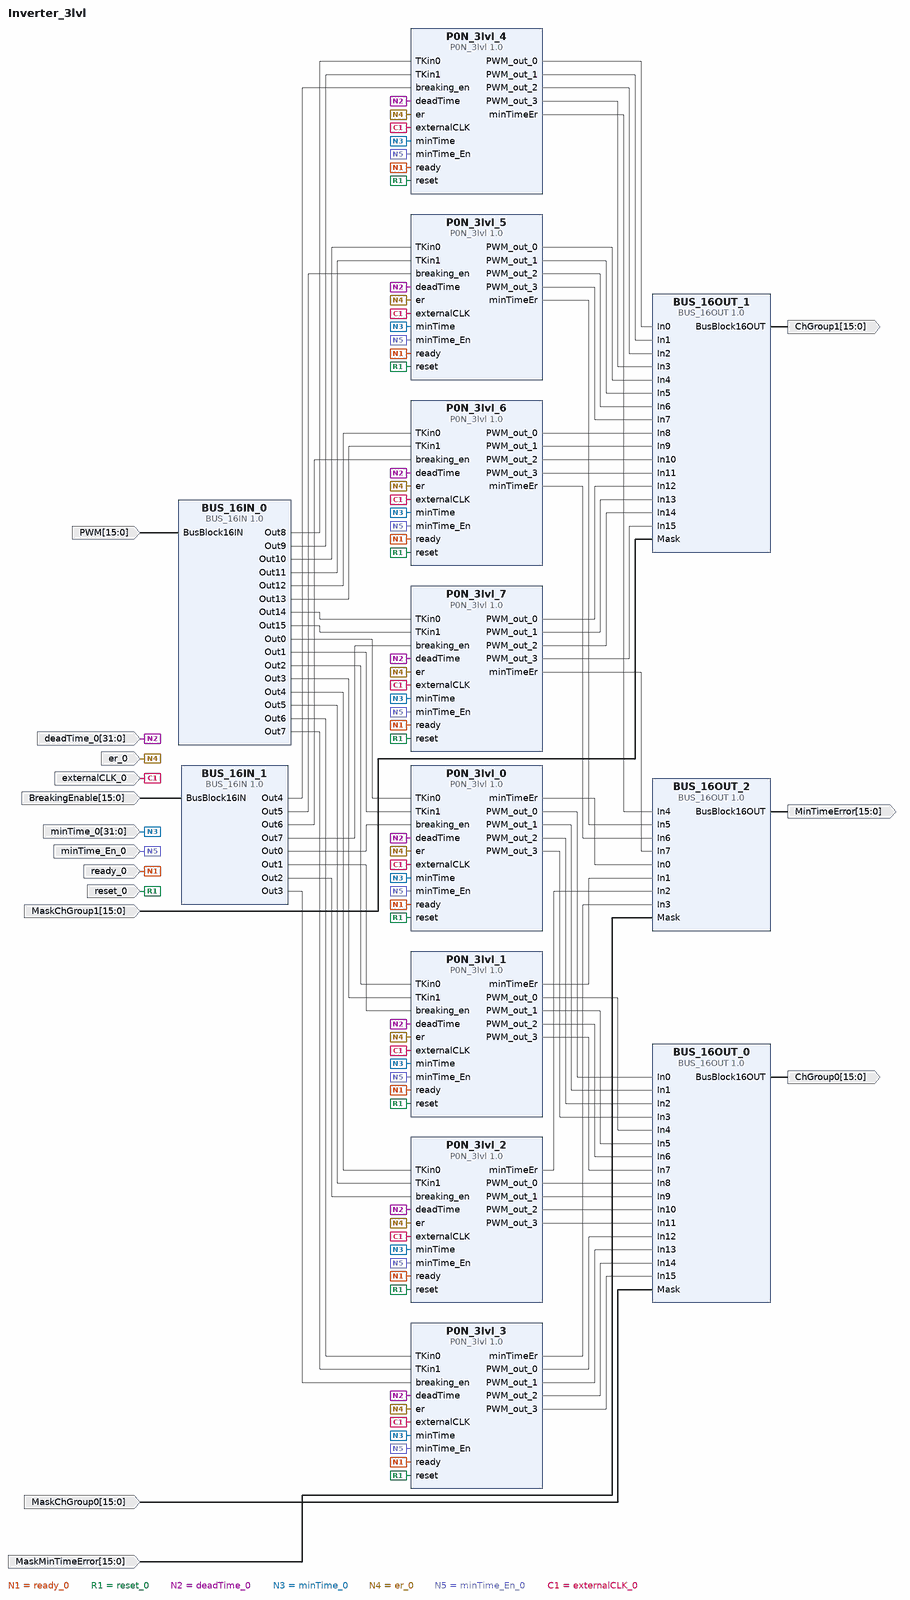
[diagram p0: block diagram of the top level]
# Vivado block design Inverter_3lvl, xc7z020clg484-3, Vivado 2019.1
create_bd_design Inverter_3lvl

create_bd_port -dir I ready_0
create_bd_port -dir I -type rst reset_0
create_bd_port -dir I -from 31 -to 0 deadTime_0
create_bd_port -dir I -from 31 -to 0 minTime_0
create_bd_port -dir I er_0
create_bd_port -dir I minTime_En_0
create_bd_port -dir I -from 15 -to 0 -type data BreakingEnable
create_bd_port -dir I -from 15 -to 0 -type data PWM
create_bd_port -dir O -from 15 -to 0 -type data ChGroup0
create_bd_port -dir O -from 15 -to 0 -type data ChGroup1
create_bd_port -dir O -from 15 -to 0 -type data MinTimeError
create_bd_port -dir I -from 15 -to 0 MaskChGroup1
create_bd_port -dir I -from 15 -to 0 MaskMinTimeError
create_bd_port -dir I -from 15 -to 0 MaskChGroup0
create_bd_port -dir I externalCLK_0

create_bd_cell -type ip -vlnv setcorp:user:BUS_16OUT:1.0 BUS_16OUT_0
create_bd_cell -type ip -vlnv setcorp:user:BUS_16OUT:1.0 BUS_16OUT_1
create_bd_cell -type ip -vlnv setcorp:user:BUS_16OUT:1.0 BUS_16OUT_2
create_bd_cell -type ip -vlnv setcorp:user:BUS_16IN:1.0 BUS_16IN_0
create_bd_cell -type ip -vlnv setcorp:user:BUS_16IN:1.0 BUS_16IN_1
create_bd_cell -type ip -vlnv ssevendenergy.com:user:P0N_3lvl:1.0 P0N_3lvl_0
create_bd_cell -type ip -vlnv ssevendenergy.com:user:P0N_3lvl:1.0 P0N_3lvl_3
create_bd_cell -type ip -vlnv ssevendenergy.com:user:P0N_3lvl:1.0 P0N_3lvl_4
create_bd_cell -type ip -vlnv ssevendenergy.com:user:P0N_3lvl:1.0 P0N_3lvl_5
create_bd_cell -type ip -vlnv ssevendenergy.com:user:P0N_3lvl:1.0 P0N_3lvl_6
create_bd_cell -type ip -vlnv ssevendenergy.com:user:P0N_3lvl:1.0 P0N_3lvl_7
create_bd_cell -type ip -vlnv ssevendenergy.com:user:P0N_3lvl:1.0 P0N_3lvl_1
create_bd_cell -type ip -vlnv ssevendenergy.com:user:P0N_3lvl:1.0 P0N_3lvl_2

# ---- connections ----

connect_bd_net -net ready_0_1 [get_bd_ports ready_0] \
  [get_bd_pins P0N_3lvl_0/ready] [get_bd_pins P0N_3lvl_3/ready] [get_bd_pins P0N_3lvl_4/ready] [get_bd_pins P0N_3lvl_5/ready] \
  [get_bd_pins P0N_3lvl_6/ready] [get_bd_pins P0N_3lvl_7/ready] [get_bd_pins P0N_3lvl_1/ready] [get_bd_pins P0N_3lvl_2/ready]
connect_bd_net -net reset_0_1 [get_bd_ports reset_0] \
  [get_bd_pins P0N_3lvl_0/reset] [get_bd_pins P0N_3lvl_3/reset] [get_bd_pins P0N_3lvl_4/reset] [get_bd_pins P0N_3lvl_5/reset] \
  [get_bd_pins P0N_3lvl_6/reset] [get_bd_pins P0N_3lvl_7/reset] [get_bd_pins P0N_3lvl_1/reset] [get_bd_pins P0N_3lvl_2/reset]
connect_bd_net -net deadTime_0_1 [get_bd_ports deadTime_0] \
  [get_bd_pins P0N_3lvl_0/deadTime] [get_bd_pins P0N_3lvl_3/deadTime] [get_bd_pins P0N_3lvl_4/deadTime] \
  [get_bd_pins P0N_3lvl_5/deadTime] [get_bd_pins P0N_3lvl_6/deadTime] [get_bd_pins P0N_3lvl_7/deadTime] \
  [get_bd_pins P0N_3lvl_1/deadTime] [get_bd_pins P0N_3lvl_2/deadTime]
connect_bd_net -net minTime_0_1 [get_bd_ports minTime_0] \
  [get_bd_pins P0N_3lvl_0/minTime] [get_bd_pins P0N_3lvl_3/minTime] [get_bd_pins P0N_3lvl_4/minTime] \
  [get_bd_pins P0N_3lvl_5/minTime] [get_bd_pins P0N_3lvl_6/minTime] [get_bd_pins P0N_3lvl_7/minTime] \
  [get_bd_pins P0N_3lvl_1/minTime] [get_bd_pins P0N_3lvl_2/minTime]
connect_bd_net -net er_0_1 [get_bd_ports er_0] \
  [get_bd_pins P0N_3lvl_0/er] [get_bd_pins P0N_3lvl_3/er] [get_bd_pins P0N_3lvl_4/er] [get_bd_pins P0N_3lvl_5/er] \
  [get_bd_pins P0N_3lvl_6/er] [get_bd_pins P0N_3lvl_7/er] [get_bd_pins P0N_3lvl_1/er] [get_bd_pins P0N_3lvl_2/er]
connect_bd_net -net minTime_En_0_1 [get_bd_ports minTime_En_0] \
  [get_bd_pins P0N_3lvl_0/minTime_En] [get_bd_pins P0N_3lvl_3/minTime_En] [get_bd_pins P0N_3lvl_4/minTime_En] \
  [get_bd_pins P0N_3lvl_5/minTime_En] [get_bd_pins P0N_3lvl_6/minTime_En] [get_bd_pins P0N_3lvl_7/minTime_En] \
  [get_bd_pins P0N_3lvl_1/minTime_En] [get_bd_pins P0N_3lvl_2/minTime_En]
connect_bd_net [get_bd_ports PWM] [get_bd_pins BUS_16IN_0/BusBlock16IN]
connect_bd_net [get_bd_pins BUS_16IN_0/Out0] [get_bd_pins P0N_3lvl_0/TKin0]
connect_bd_net [get_bd_pins BUS_16IN_0/Out1] [get_bd_pins P0N_3lvl_0/TKin1]
connect_bd_net [get_bd_pins BUS_16IN_0/Out2] [get_bd_pins P0N_3lvl_1/TKin0]
connect_bd_net [get_bd_pins BUS_16IN_0/Out3] [get_bd_pins P0N_3lvl_1/TKin1]
connect_bd_net [get_bd_pins BUS_16IN_0/Out4] [get_bd_pins P0N_3lvl_2/TKin0]
connect_bd_net [get_bd_pins BUS_16IN_0/Out5] [get_bd_pins P0N_3lvl_2/TKin1]
connect_bd_net [get_bd_pins BUS_16IN_0/Out6] [get_bd_pins P0N_3lvl_3/TKin0]
connect_bd_net [get_bd_pins BUS_16IN_0/Out7] [get_bd_pins P0N_3lvl_3/TKin1]
connect_bd_net [get_bd_pins BUS_16IN_0/Out8] [get_bd_pins P0N_3lvl_4/TKin0]
connect_bd_net [get_bd_pins BUS_16IN_0/Out9] [get_bd_pins P0N_3lvl_4/TKin1]
connect_bd_net [get_bd_pins BUS_16IN_0/Out10] [get_bd_pins P0N_3lvl_5/TKin0]
connect_bd_net [get_bd_pins BUS_16IN_0/Out11] [get_bd_pins P0N_3lvl_5/TKin1]
connect_bd_net [get_bd_pins BUS_16IN_0/Out12] [get_bd_pins P0N_3lvl_6/TKin0]
connect_bd_net [get_bd_pins BUS_16IN_0/Out13] [get_bd_pins P0N_3lvl_6/TKin1]
connect_bd_net [get_bd_pins BUS_16IN_0/Out14] [get_bd_pins P0N_3lvl_7/TKin0]
connect_bd_net [get_bd_pins BUS_16IN_0/Out15] [get_bd_pins P0N_3lvl_7/TKin1]
connect_bd_net [get_bd_ports BreakingEnable] [get_bd_pins BUS_16IN_1/BusBlock16IN]
connect_bd_net [get_bd_pins BUS_16IN_1/Out0] [get_bd_pins P0N_3lvl_0/breaking_en]
connect_bd_net [get_bd_pins BUS_16IN_1/Out1] [get_bd_pins P0N_3lvl_1/breaking_en]
connect_bd_net [get_bd_pins BUS_16IN_1/Out2] [get_bd_pins P0N_3lvl_2/breaking_en]
connect_bd_net [get_bd_pins BUS_16IN_1/Out3] [get_bd_pins P0N_3lvl_3/breaking_en]
connect_bd_net [get_bd_pins BUS_16IN_1/Out4] [get_bd_pins P0N_3lvl_4/breaking_en]
connect_bd_net [get_bd_pins BUS_16IN_1/Out5] [get_bd_pins P0N_3lvl_5/breaking_en]
connect_bd_net [get_bd_pins BUS_16IN_1/Out6] [get_bd_pins P0N_3lvl_6/breaking_en]
connect_bd_net [get_bd_pins BUS_16IN_1/Out7] [get_bd_pins P0N_3lvl_7/breaking_en]
connect_bd_net [get_bd_pins BUS_16OUT_0/BusBlock16OUT] [get_bd_ports ChGroup0]
connect_bd_net [get_bd_pins P0N_3lvl_0/PWM_out_0] [get_bd_pins BUS_16OUT_0/In0]
connect_bd_net [get_bd_pins P0N_3lvl_0/PWM_out_1] [get_bd_pins BUS_16OUT_0/In1]
connect_bd_net [get_bd_pins P0N_3lvl_0/PWM_out_2] [get_bd_pins BUS_16OUT_0/In2]
connect_bd_net [get_bd_pins P0N_3lvl_0/PWM_out_3] [get_bd_pins BUS_16OUT_0/In3]
connect_bd_net [get_bd_pins P0N_3lvl_1/PWM_out_0] [get_bd_pins BUS_16OUT_0/In4]
connect_bd_net [get_bd_pins P0N_3lvl_1/PWM_out_1] [get_bd_pins BUS_16OUT_0/In5]
connect_bd_net [get_bd_pins P0N_3lvl_1/PWM_out_2] [get_bd_pins BUS_16OUT_0/In6]
connect_bd_net [get_bd_pins P0N_3lvl_1/PWM_out_3] [get_bd_pins BUS_16OUT_0/In7]
connect_bd_net [get_bd_pins P0N_3lvl_2/PWM_out_0] [get_bd_pins BUS_16OUT_0/In8]
connect_bd_net [get_bd_pins P0N_3lvl_2/PWM_out_1] [get_bd_pins BUS_16OUT_0/In9]
connect_bd_net [get_bd_pins P0N_3lvl_2/PWM_out_2] [get_bd_pins BUS_16OUT_0/In10]
connect_bd_net [get_bd_pins P0N_3lvl_2/PWM_out_3] [get_bd_pins BUS_16OUT_0/In11]
connect_bd_net [get_bd_pins P0N_3lvl_3/PWM_out_0] [get_bd_pins BUS_16OUT_0/In12]
connect_bd_net [get_bd_pins P0N_3lvl_3/PWM_out_1] [get_bd_pins BUS_16OUT_0/In13]
connect_bd_net [get_bd_pins P0N_3lvl_3/PWM_out_2] [get_bd_pins BUS_16OUT_0/In14]
connect_bd_net [get_bd_pins P0N_3lvl_3/PWM_out_3] [get_bd_pins BUS_16OUT_0/In15]
connect_bd_net [get_bd_pins BUS_16OUT_1/BusBlock16OUT] [get_bd_ports ChGroup1]
connect_bd_net [get_bd_pins P0N_3lvl_4/PWM_out_0] [get_bd_pins BUS_16OUT_1/In0]
connect_bd_net [get_bd_pins P0N_3lvl_4/PWM_out_1] [get_bd_pins BUS_16OUT_1/In1]
connect_bd_net [get_bd_pins P0N_3lvl_4/PWM_out_2] [get_bd_pins BUS_16OUT_1/In2]
connect_bd_net [get_bd_pins P0N_3lvl_4/PWM_out_3] [get_bd_pins BUS_16OUT_1/In3]
connect_bd_net [get_bd_pins P0N_3lvl_5/PWM_out_0] [get_bd_pins BUS_16OUT_1/In4]
connect_bd_net [get_bd_pins P0N_3lvl_5/PWM_out_1] [get_bd_pins BUS_16OUT_1/In5]
connect_bd_net [get_bd_pins P0N_3lvl_5/PWM_out_2] [get_bd_pins BUS_16OUT_1/In6]
connect_bd_net [get_bd_pins P0N_3lvl_5/PWM_out_3] [get_bd_pins BUS_16OUT_1/In7]
connect_bd_net [get_bd_pins P0N_3lvl_6/PWM_out_0] [get_bd_pins BUS_16OUT_1/In8]
connect_bd_net [get_bd_pins P0N_3lvl_6/PWM_out_1] [get_bd_pins BUS_16OUT_1/In9]
connect_bd_net [get_bd_pins P0N_3lvl_6/PWM_out_2] [get_bd_pins BUS_16OUT_1/In10]
connect_bd_net [get_bd_pins P0N_3lvl_6/PWM_out_3] [get_bd_pins BUS_16OUT_1/In11]
connect_bd_net [get_bd_pins P0N_3lvl_7/PWM_out_0] [get_bd_pins BUS_16OUT_1/In12]
connect_bd_net [get_bd_pins P0N_3lvl_7/PWM_out_1] [get_bd_pins BUS_16OUT_1/In13]
connect_bd_net [get_bd_pins P0N_3lvl_7/PWM_out_2] [get_bd_pins BUS_16OUT_1/In14]
connect_bd_net [get_bd_pins P0N_3lvl_7/PWM_out_3] [get_bd_pins BUS_16OUT_1/In15]
connect_bd_net -net MaskChGroup0_1 [get_bd_ports MaskChGroup0] [get_bd_pins BUS_16OUT_0/Mask]
connect_bd_net -net MaskChGroup1_1 [get_bd_ports MaskChGroup1] [get_bd_pins BUS_16OUT_1/Mask]
connect_bd_net [get_bd_pins P0N_3lvl_0/minTimeEr] [get_bd_pins BUS_16OUT_2/In0]
connect_bd_net [get_bd_pins P0N_3lvl_1/minTimeEr] [get_bd_pins BUS_16OUT_2/In1]
connect_bd_net [get_bd_pins P0N_3lvl_2/minTimeEr] [get_bd_pins BUS_16OUT_2/In2]
connect_bd_net [get_bd_pins P0N_3lvl_3/minTimeEr] [get_bd_pins BUS_16OUT_2/In3]
connect_bd_net [get_bd_pins P0N_3lvl_4/minTimeEr] [get_bd_pins BUS_16OUT_2/In4]
connect_bd_net [get_bd_pins P0N_3lvl_5/minTimeEr] [get_bd_pins BUS_16OUT_2/In5]
connect_bd_net [get_bd_pins P0N_3lvl_6/minTimeEr] [get_bd_pins BUS_16OUT_2/In6]
connect_bd_net [get_bd_pins P0N_3lvl_7/minTimeEr] [get_bd_pins BUS_16OUT_2/In7]
connect_bd_net [get_bd_pins BUS_16OUT_2/BusBlock16OUT] [get_bd_ports MinTimeError]
connect_bd_net [get_bd_ports MaskMinTimeError] [get_bd_pins BUS_16OUT_2/Mask]
connect_bd_net -net externalCLK_0_1 [get_bd_ports externalCLK_0] \
  [get_bd_pins P0N_3lvl_0/externalCLK] [get_bd_pins P0N_3lvl_3/externalCLK] [get_bd_pins P0N_3lvl_4/externalCLK] \
  [get_bd_pins P0N_3lvl_5/externalCLK] [get_bd_pins P0N_3lvl_6/externalCLK] [get_bd_pins P0N_3lvl_7/externalCLK] \
  [get_bd_pins P0N_3lvl_1/externalCLK] [get_bd_pins P0N_3lvl_2/externalCLK]

validate_bd_design
save_bd_design
